# EAGLE design PCB design (EAGLE 9.6.0)
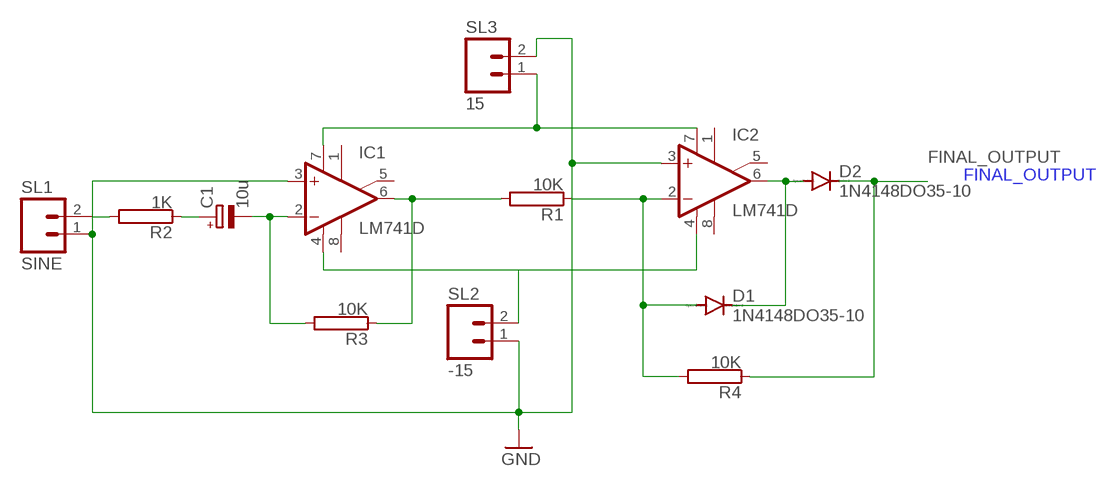
[diagram p0: schematic, sheet 1]

## Parts
C1  10u  CPOL-EUE2.5-5  [E2,5-5]
D1  1N4148DO35-10  [DO35-10]
D2  1N4148DO35-10  [DO35-10]
IC1  LM741D  [SO08]
IC2  LM741D  [SO08]
R1  10K  RMG100-V  [TO-247-2V]
R2  1K  RMG100-V  [TO-247-2V]
R3  10K  RMG100-V  [TO-247-2V]
R4  10K  RMG100-V  [TO-247-2V]
SL1  SINE  M02  [02P]
SL2  -15  M02  [02P]
SL3  15  M02  [02P]

## Nets
FINAL_OUTPUT: D2.C R4.1
GND: IC1.3(+IN) IC2.3(+IN) SL1.1 SL2.1 SL3.2
N$1: C1.+ R2.1
N$2: IC1.6(OUT) R1.2 R3.1
N$3: D1.A IC2.2(-IN) R1.1 R4.2
N$5: D1.C D2.A IC2.6(OUT)
N$6: IC1.7(V+) IC2.7(V+) SL3.1
N$7: IC1.4(V-) IC2.4(V-) SL2.2
N$8: R2.2 SL1.2
N$9: C1.- IC1.2(-IN) R3.2
Unconnected: IC1.1(ON1) IC1.5(ON2) IC1.8(OPT) IC2.1(ON1) IC2.5(ON2) IC2.8(OPT)

## Library data of the parts
C1 = rcl:CPOL-EU: POLARIZED CAPACITOR, European symbol; SPICEPREFIX: C
D1 D2 = diode:1N4148: DIODE high speed (Philips)
IC1 IC2 = linear:*741: OP AMP
R1-R4 = resistor-power:RMG100: TO-247 Power Resistor - RMG 100 Series Source: www.token.com.tw .. power-resistor-rmg100pdf; OC_FARNELL: unknown; OC_NEWARK: unknown
SL1-SL3 = con-amp-quick:M02: AMP QUICK CONNECTOR; OC_FARNELL: unknown; OC_NEWARK: unknown

## Board
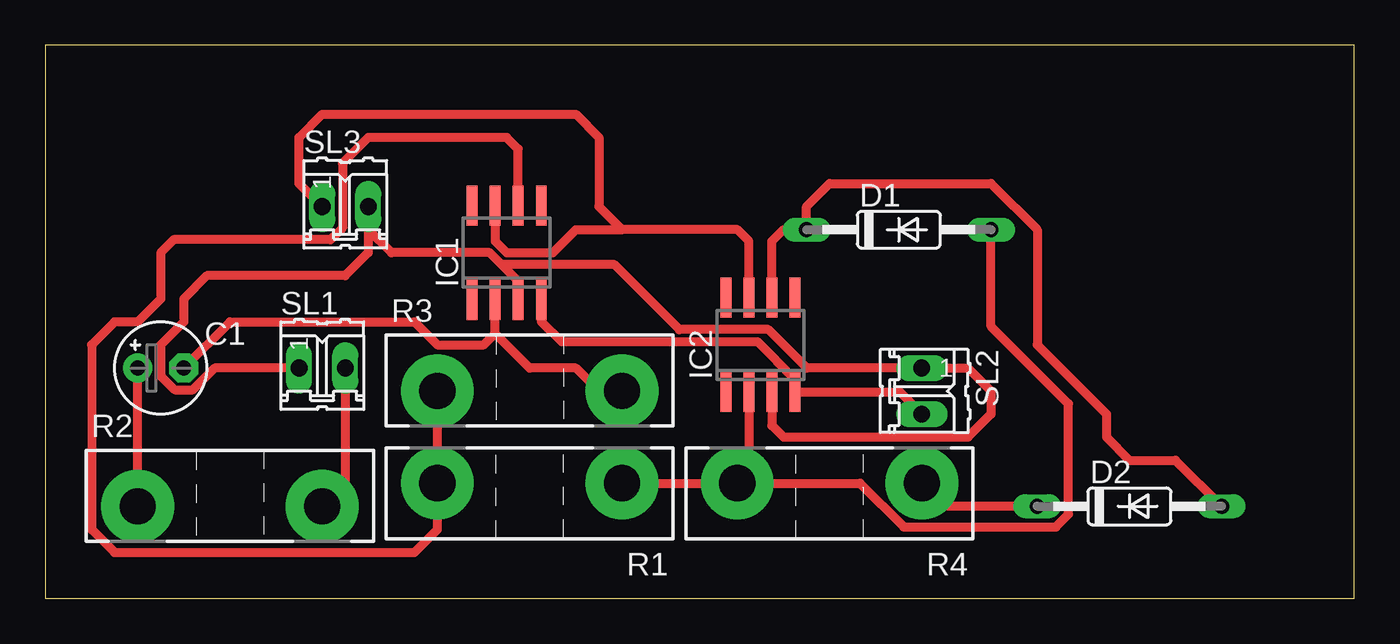
[diagram p1: board, top side]

Size 72.06 x 30.47 mm. Coordinates in mm from the lower left corner, seen from the top.
Outline: 0,0 72.06,0 72.06,30.47 0,30.47 0,0
Copper layers (1*16): Top 0.035mm / dielectric 1.5mm / Bottom 0.035mm
Design rules "default": minimum track width 6mil, minimum drill 0.35mm, track to track 6mil, track to pad 6mil, pad to pad 6mil, via to via 6mil, smd to smd 6mil, copper to edge 40mil, drill to drill 6mil, minimum pad ring 10mil, minimum via ring 8mil, stop-mask expansion 4mil, vias tented up to drill 0mil, thermal gap 10mil

### Footprints (pad centres in the part's own frame; a part is rotated, then mirrored left to right if it is on the bottom)
E2,5-5 = drill 0.813 pad 1.6: + -1.27,0 | drill 0.813 pad 1.6 octagon: - 1.27,0
DO35-10 = drill 0.813 long: A 5.08,0; C -5.08,0
SO08 = smd 0.6 x 2.2: 1 -1.905,-2.6; 2 -0.635,-2.6; 3 0.635,-2.6; 4 1.905,-2.6; 5 1.905,2.6; 6 0.635,2.6; 7 -0.635,2.6; 8 -1.905,2.6
TO-247-2V = drill 2 pad 4: 1 -5.08,0; 2 5.08,0
02P = drill 0.914 long: 1 -1.27,0; 2 1.27,0

### Placement (x,y rotation side)
C1  6.35,12.7 0 top
D1  46.99,20.32 0 top
D2  59.69,5.08 0 top
IC1  25.4,19.05 0 top
IC2  39.37,13.97 0 top
R1  26.67,6.35 180 top
R2  10.16,5.08 0 top
R3  26.67,11.43 0 top
R4  43.18,6.35 180 top
SL1  15.24,12.7 0 top
SL2  48.26,11.43 270 top
SL3  16.51,21.59 0 top

### Tracks (layer width: path | path; a pad name or v marks a point on that pad's centre or on a via)
FINAL_OUTPUT
  Top 0.508: D2.C 49.53,5.08 R4.1
GND
  Top 0.508: SL1.1 9.33,12.7 8.12,11.49 7.12,11.49 6.35,12.26 6.35,13.97 7.62,15.24 7.62,16.51 8.89,17.78 16.51,17.78 17.78,19.05 SL3.2 17.78,20.32 19.05,19.05 24.47,19.05 25.13,18.39 | 25.13,18.39 31.33,18.39 34.91,14.81 39.81,14.81 41.92,12.7 SL2.1 50.8,12.7 52.07,11.43 52.07,10.16 50.8,8.89 40.64,8.89 40,9.52 IC2.3 | IC1.3 26.04,17.48 25.13,18.39
N$1
  Top 0.508: R2.1 C1.+
N$2
  Top 0.508: R3.1 R1.2 21.59,3.81 20.32,2.54 3.81,2.54 2.54,3.81 2.54,13.97 3.81,15.24 5.08,15.24 6.35,16.51 6.35,19.05 7.06,19.76 15.7,19.76 16.36,20.42 16.36,23.98 17.78,25.4 25.4,25.4 26.04,24.77 IC1.6
N$3
  Top 0.508: R1.1 R4.2 | R4.2 44.86,6.35 47.26,3.94 55.64,3.94 56.34,4.64 56.34,10.73 52.07,14.99 D1.A | IC2.2 38.73,8.25 38.1,7.62 R4.2
N$5
  Top 0.508: IC2.6 40,19.68 40.64,20.32 D1.C 41.91,21.59 43.18,22.86 52.07,22.86 54.61,20.32 54.61,13.97 58.42,10.16 58.42,8.89 59.69,7.62 62.23,7.62 D2.A
N$6
  Top 0.508: SL3.1 13.97,22.86 13.97,25.4 15.24,26.67 29.21,26.67 30.48,25.4 30.48,21.59 31.75,20.32 | 24.76,20.95 IC1.7 24.76,19.68 25.4,19.05 27.94,19.05 29.21,20.32 31.75,20.32 | IC2.7 38.73,19.68 38.1,20.32 31.75,20.32
N$7
  Top 0.508: SL2.2 47.05,11.37 IC2.4 41.28,12.07 39.2,14.15 28.42,14.15 27.3,15.27 IC1.4
N$8
  Top 0.508: SL1.2 16.51,6.35 R2.2
N$9
  Top 0.508: C1.- 10.16,15.24 20.32,15.24 21.59,13.97 24.13,13.97 24.76,14.6 | R3.2 30.48,11.43 29.21,12.7 26.67,12.7 24.76,14.6 | 24.76,14.6 IC1.2